# EAGLE design MPHS (EAGLE 6.5.0)
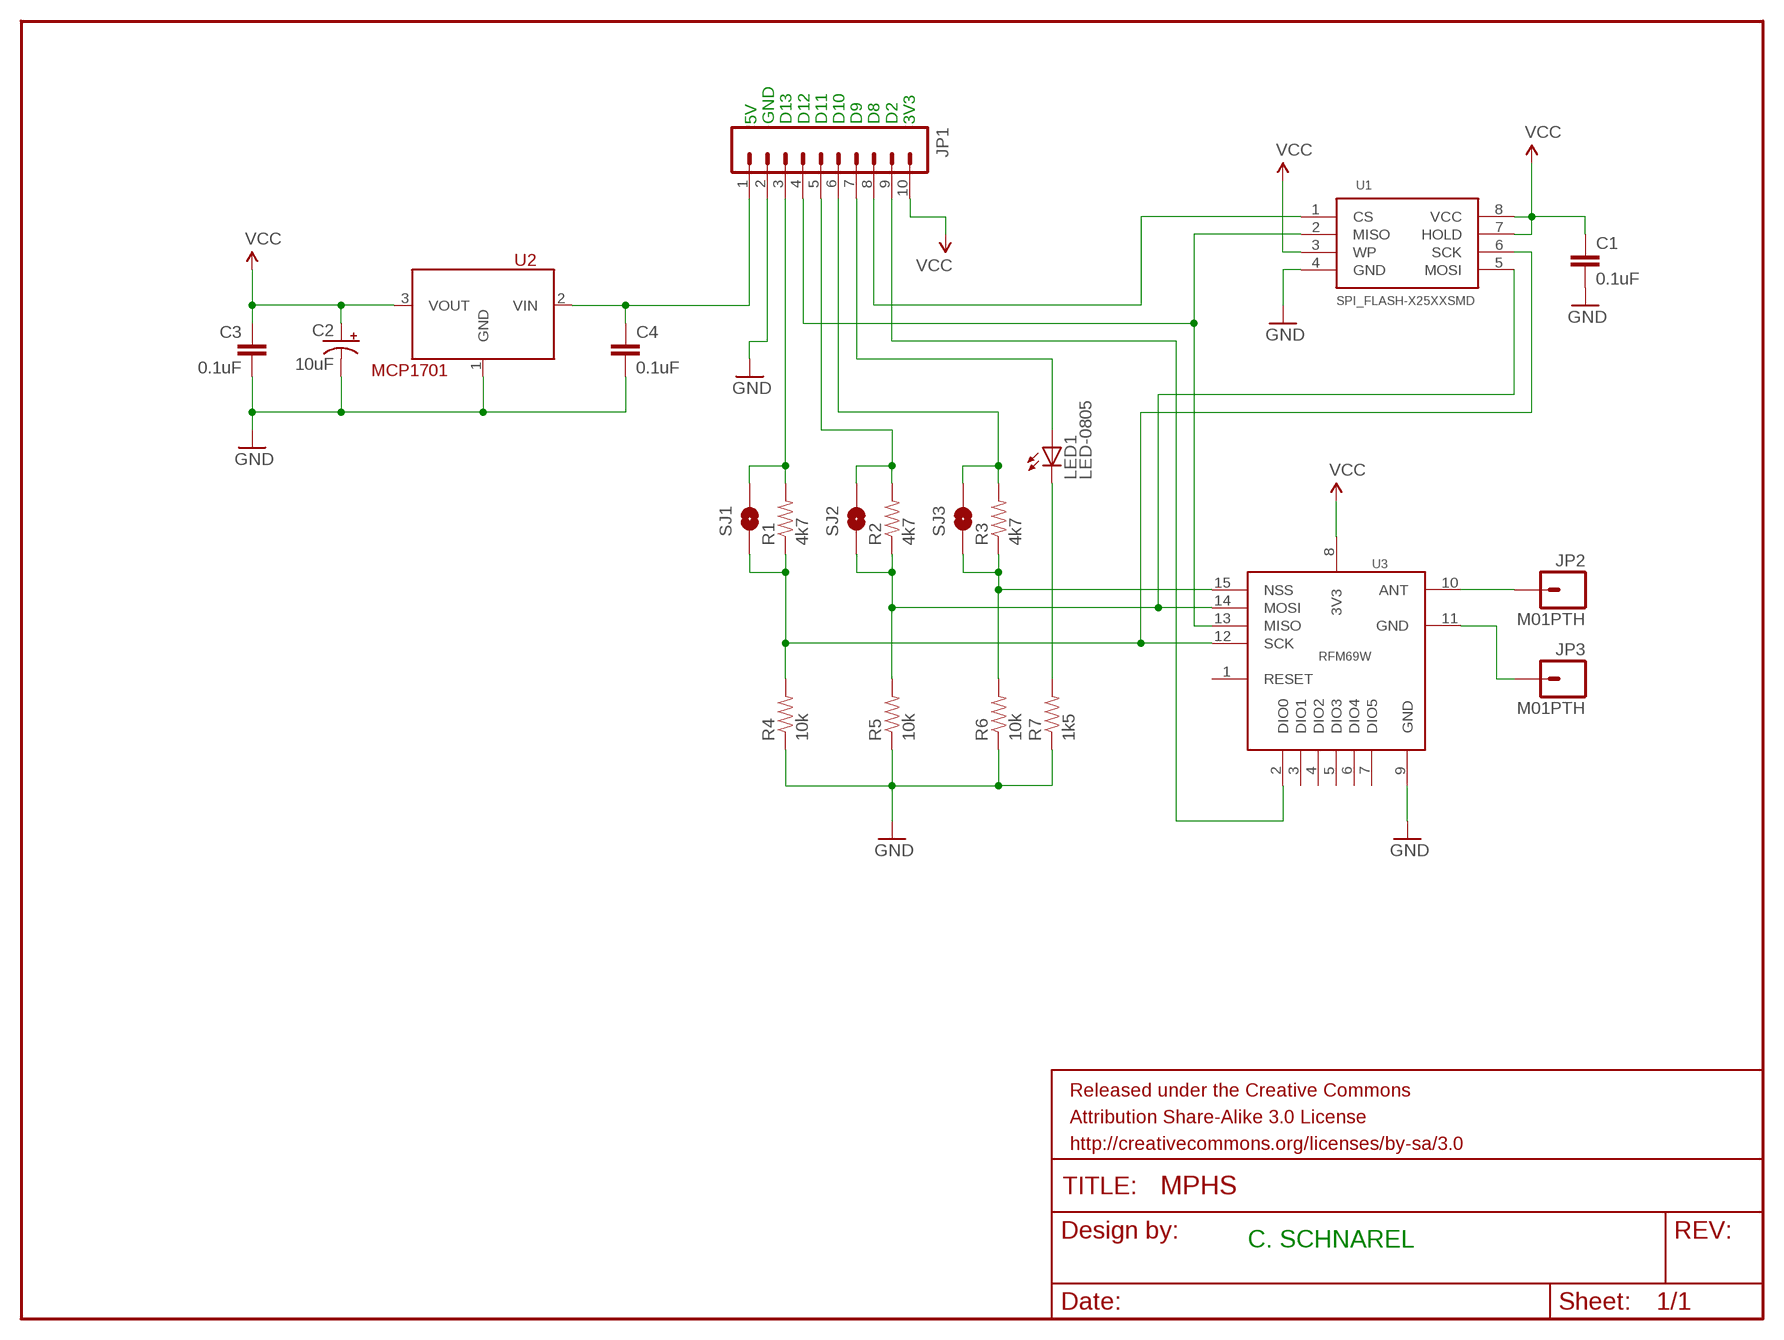
[diagram p0: schematic, sheet 1]

## Parts
C1  0.1uF  CAP0805  [0805]
C2  10uF  CAP_POL0805  [0805-POL]
C3  0.1uF  CAP0805  [0805]
C4  0.1uF  CAP0805  [0805]
FRAME1  FRAME-LETTER  [CREATIVE_COMMONS]
JP1  M10"  [1X10]
JP2  M01PTH  [1X01]
JP3  M01PTH  [1X01]
LED1  LED-0805  [0805-LED]
R1  4k7  RESISTOR0805-RES  [0805]
R2  4k7  RESISTOR0805-RES  [0805]
R3  4k7  RESISTOR0805-RES  [0805]
R4  10k  RESISTOR0805-RES  [0805]
R5  10k  RESISTOR0805-RES  [0805]
R6  10k  RESISTOR0805-RES  [0805]
R7  1k5  RESISTOR0805-RES  [0805]
SJ1  SOLDERJUMPERNO  [SJ_2S-NO]
SJ2  SOLDERJUMPERNO  [SJ_2S-NO]
SJ3  SOLDERJUMPERNO  [SJ_2S-NO]
U1  SPI_FLASH-X25XXSMD  [SO08]
U2  MCP1701  [SOT-89]
U3  RFM69W  [RFM69W]

## Nets
GND: C1.2 C2.2(-) C3.2 C4.2 JP1.2 R4.1 R5.1 R6.1 R7.1 U1.4(GND) U2.1(GND) U3.9(GND)
N$1: R3.1 R6.2 SJ3.1 U3.15(NSS)
N$2: C4.1 JP1.1 U2.2(VIN)
N$3: JP1.4 U1.2(MISO) U3.13(MISO)
N$4: JP1.9 U3.2(DIO0)
N$5: R2.1 R5.2 SJ2.1 U1.5(MOSI) U3.14(MOSI)
N$6: JP1.3 R1.2 SJ1.2
N$7: JP1.5 R2.2 SJ2.2
N$9: JP1.6 R3.2 SJ3.2
N$10: R1.1 R4.2 SJ1.1 U1.6(SCK) U3.12(SCK)
N$11: JP2.1 U3.10(ANT)
N$12: JP3.1 U3.11(GND)
N$13: JP1.7 LED1.A
N$14: JP1.8 U1.1(CS)
N$15: LED1.C R7.2
VCC: C1.1 C2.1(+) C3.1 JP1.10 U1.3(WP) U1.7(HOLD) U1.8(VCC) U2.3(VOUT) U3.8(3V3)
Unconnected: U3.1(RESET) U3.3(DIO1) U3.4(DIO2) U3.5(DIO3) U3.6(DIO4) U3.7(DIO5)

## Notes on the sheet
- 5V
  GND
  D13
  D12
  D11
  D10
  D9
  D8
  D2
  3V3
- C. SCHNAREL

## Library data of the parts
C1 C3 C4 = SparkFun-Capacitors:CAP: Capacitor Standard 0603 ceramic capacitor, and 0.1" leaded capacitor.
C2 = ChipsParts:CAP_POL
FRAME1 = SparkFun-Aesthetics:FRAME-LETTER: Schematic Frame Standard 8.5x11 US Letter frame
JP1 = SparkFun-Connectors:M10: Header 10 Standard 10-pin 0.1" header. Use with straight break away headers (SKU : PRT-00116), right angle break away headers (PRT-00553), swiss pins (PRT-00743), machine pins (PRT-00117), and female headers (PRT-00115).
JP2 JP3 = SparkFun-Connectors:M01: Header 1 Standard 1-pin 0.1" header. Use with straight break away headers (SKU : PRT-00116), right angle break away headers (PRT-00553), swiss pins (PRT-00743), machine pins (PRT-00117), and female headers (PRT-00115).
LED1 = ChipsParts:LED: Generic LED in 0805 package. Both package and symbol copied from SparkFun libraries but they don't have a component LED in 0805.
R1-R7 = SparkFun-Resistors:RESISTOR: Resistor Basic schematic elements and footprints for 0603, 1206, and PTH resistors.
SJ1-SJ3 = SparkFun-Passives:SOLDERJUMPER: Solder Jumper Standard SMD solder jumper. Used to automate production. Two varients : Normally Open and Normally Closed are the same, but have different paste layers. NC will have a large amount of paste and should jumper during reflow.
U1 = SparkFun-DigitalIC:SPI_FLASH-X25XX: 8pin SPI Flash series x25xx. Works with devices like W25X32 and BR25L32
U2 = ChipsParts:MCP1701: Voltage Regulator, LDO, fixed 1.8,2.5,3.0,3.3,5.0V, 500mW/Vdrop
U3 = ChipsParts:RFM69W: Radio Transceiver Module, FSK, 433, 848, 915 MHz, SPI controlled, Mfr=HopeRF

## Board
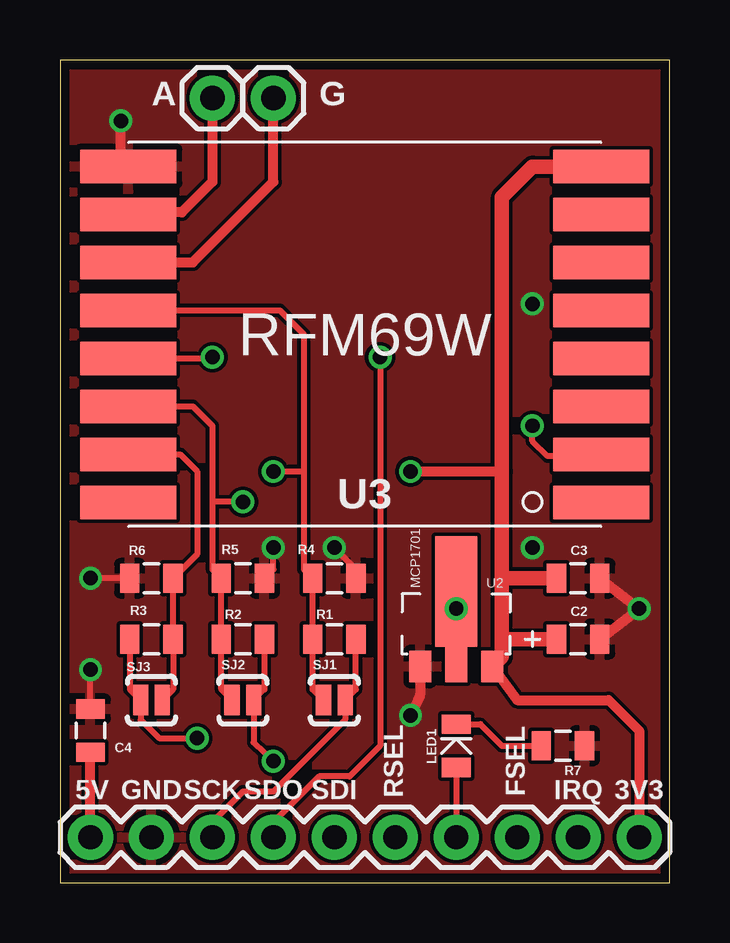
[diagram p1: board, top side]
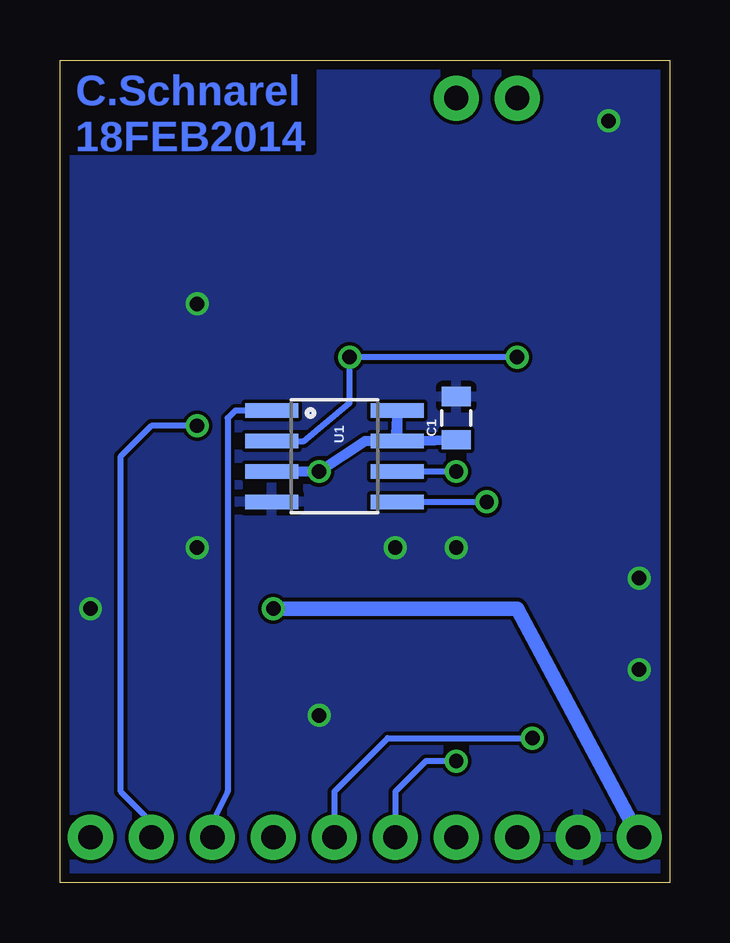
[diagram p2: board, bottom side, seen from below]

Size 25.4 x 34.29 mm. Coordinates in mm from the lower left corner, seen from the top.
Outline: 0,0 25.4,0 25.4,34.29 0,34.29 0,0
Copper layers (1*16): Top 0.0356mm / dielectric 1.5011mm / Bottom 0.0356mm
Design rules "LaenPCBOrder": minimum track width 6mil, minimum drill 13mil, track to track 6mil, track to pad 6mil, pad to pad 6mil, via to via 6mil, smd to smd 6mil, copper to edge 15mil, drill to drill 6mil, minimum pad ring 7mil, minimum via ring 7mil, stop-mask expansion 4mil, vias tented up to drill 0mil, thermal gap 10mil

### Footprints (pad centres in the part's own frame; a part is rotated, then mirrored left to right if it is on the bottom)
0805 = smd 0.8 x 1.2: 1 -0.9,0; 2 0.9,0
0805-POL = smd 0.8 x 1.2: 1 -0.9,0; 2 0.9,0
1X10 = drill 1.016 pad 1.88: 1 0,0; 2 2.54,0; 3 5.08,0; 4 7.62,0; 5 10.16,0; 6 12.7,0; 7 15.24,0; 8 17.78,0; 9 20.32,0; 10 22.86,0
1X01 = drill 1.016 pad 1.88: 1 0,0
0805-LED = smd 0.8 x 1.2: A -0.9,0; C 0.9,0
SJ_2S-NO = smd 0.635 x 1.27: 1 -0.45,0; 2 0.45,0
SO08 = smd 0.61 x 2.21: 1 -1.905,-2.616; 2 -0.635,-2.616; 3 0.635,-2.616; 4 1.905,-2.616; 5 1.905,2.616; 6 0.635,2.616; 7 -0.635,2.616; 8 -1.905,2.616
SOT-89 = smd 0.9 x 1.3: 1 -1.5,-1.775; 3 1.5,-1.775 | smd 0.9 x 1.475: 2 0,-1.688 | smd 1.733 x 4.6: P$4 0,1.35
RFM69W = smd 4 x 1.4: 1 -9.85,7; 2 -9.85,5; 3 -9.85,3; 4 -9.85,1; 5 -9.85,-1; 6 -9.85,-3; 7 -9.85,-5; 8 -9.85,-7; 9 9.85,-7; 10 9.85,-5; 11 9.85,-3; 12 9.85,-1; 13 9.85,1; 14 9.85,3; 15 9.85,5; 16 9.85,7

### Placement (x,y rotation side)
C1  8.89,19.37 90 bottom
C2  21.59,10.16 0 top
C3  21.59,12.7 0 top
C4  1.27,6.35 90 top
FRAME1  17.78,-8.89 0 top  (outside the outline)
JP1  1.27,1.91 0 top
JP2  6.35,32.7 0 top
JP3  8.89,32.7 0 top
LED1  16.51,5.71 90 top
R1  11.43,10.16 0 top
R2  7.62,10.16 0 top
R3  3.81,10.16 180 top
R4  11.43,12.7 180 top
R5  7.62,12.7 180 top
R6  3.81,12.7 0 top
R7  20.95,5.71 180 top
SJ1  11.43,7.62 0 top
SJ2  7.62,7.62 0 top
SJ3  3.81,7.62 180 top
U1  13.97,17.78 270 bottom
U2  16.51,10.79 0 top
U3  12.7,22.86 180 top

### Tracks (layer width: path | path; a pad name or v marks a point on that pad's centre or on a via)
GND  (via drill 0.6)
  Top 0.254: R5.1 8.89,13.07 v8.89,13.97 | U3.9 2.54,30.17 | C4.2 v1.27,8.89 | R6.1 v1.27,12.7 | R4.1 12.33,13.07 v11.43,13.97
  Top 0.406: 2.54,30.17 v2.54,31.75 | U2.1 15.01,7.85 v14.61,6.99 | C2.2 v24.13,11.43 C3.2
  other vias: 19.68,24.13 19.68,13.97
  pour Bottom: 0,0 0,34.29 25.4,34.29 25.4,0
  pour Top: 0,0 0,34.29 25.4,34.29 25.4,0
N$1
  Top 0.254: SJ3.1 4.71,8.07 R3.1 R6.2 5.71,13.71 5.71,17.14 5,17.86 U3.15
N$2  (via drill 0.6)
  Top 0.254: U2.2 v16.51,11.43
  Top 0.406: JP1.1 C4.1
  Bottom 0.61: JP1.1 6.35,11.43 v16.51,11.43
N$3  (via drill 0.6)
  Top 0.254: U3.13 6.08,21.86 v6.35,21.91 | v13.34,21.91 13.34,5.71 12.06,4.45 10.79,4.45 8.89,2.54 JP1.4
  Bottom 0.254: v6.35,21.91 v13.34,21.91 13.34,20 15.24,18.41 U1.2
N$4  (via drill 0.6)
  Top 0.254: U3.2 21.59,17.86 21.59,17.78 20.32,17.78 19.68,18.41 v19.68,19.05
  Bottom 0.254: v19.68,19.05 21.59,19.05 22.86,17.78 22.86,3.81 21.59,2.54 JP1.9
N$5  (via drill 0.6)
  Top 0.254: SJ2.1 6.72,8.07 R2.1 R5.2 6.35,13.07 6.35,15.88 | U3.14 5.54,19.86 6.35,19.05 6.35,15.88 | v7.62,15.88 6.35,15.88
  Bottom 0.254: U1.5 v7.62,15.88
N$6
  Top 0.254: R1.2 12.33,8.07 SJ1.2 11.88,6.8 8.89,3.81 7.62,3.81 6.35,2.54 JP1.3
N$7  (via drill 0.6)
  Top 0.254: R2.2 8.52,8.07 SJ2.2 8.07,5.85 v8.89,5.08
  Bottom 0.254: v8.89,5.08 10.16,5.08 11.43,3.81 JP1.5
N$9  (via drill 0.6)
  Top 0.254: R3.2 2.91,8.07 SJ3.2 3.36,6.8 4.13,6.03 v5.71,6.03
  Bottom 0.254: v5.71,6.03 11.75,6.03 13.97,3.81 JP1.6
N$10  (via drill 0.6)
  Top 0.254: SJ1.1 10.53,8.07 R1.1 R4.2 10.16,13.07 10.16,17.14 | U3.12 9.16,23.86 10.16,22.86 10.16,17.14 | v8.89,17.14 10.16,17.14
  Bottom 0.254: U1.6 v8.89,17.14
N$11
  Top 0.254: 2.93,27.94 U3.10
  Top 0.406: JP2.1 6.35,29.21 5.08,27.94 2.93,27.94
N$12
  Top 0.254: U3.11 2.54,25.55 2.54,25.4
  Top 0.406: U3.11 5.54,25.86 8.89,29.21 JP3.1
N$13
  Top 0.254: LED1.A JP1.7
N$14
  Bottom 0.254: U1.1 18.1,19.68 18.41,19.37 18.41,3.81 19.05,2.54 JP1.8
N$15
  Top 0.254: R7.2 18.41,5.71 17.52,6.62 LED1.C
VCC  (via drill 0.6)
  Top 0.254: 22.54,29.84 U3.8 | U2.3 18.01,9.12
  Top 0.406: U2.3 19.05,7.62 22.86,7.62 24.13,6.35 JP1.10 | v14.61,17.14 18.41,17.14
  Top 0.61: 22.54,29.84 19.68,29.84 18.41,28.57 18.41,17.14 18.41,12.7 | 18.41,10.16 18.41,9.43 U2.3 | 18.41,10.16 18.41,12.7 | C3.1 18.41,12.7 | 18.41,10.16 C2.1
  Bottom 0.406: U1.3 v14.61,17.14 12.7,18.41 U1.7 U1.8 11.43,18.41 C1.1

### Text on the board
Bottom: C.Schnarel / 18FEB2014
tPlace: A | G | RSEL | FSEL | 5V | GND | SCK | SDO | SDI | IRQ | 3V3